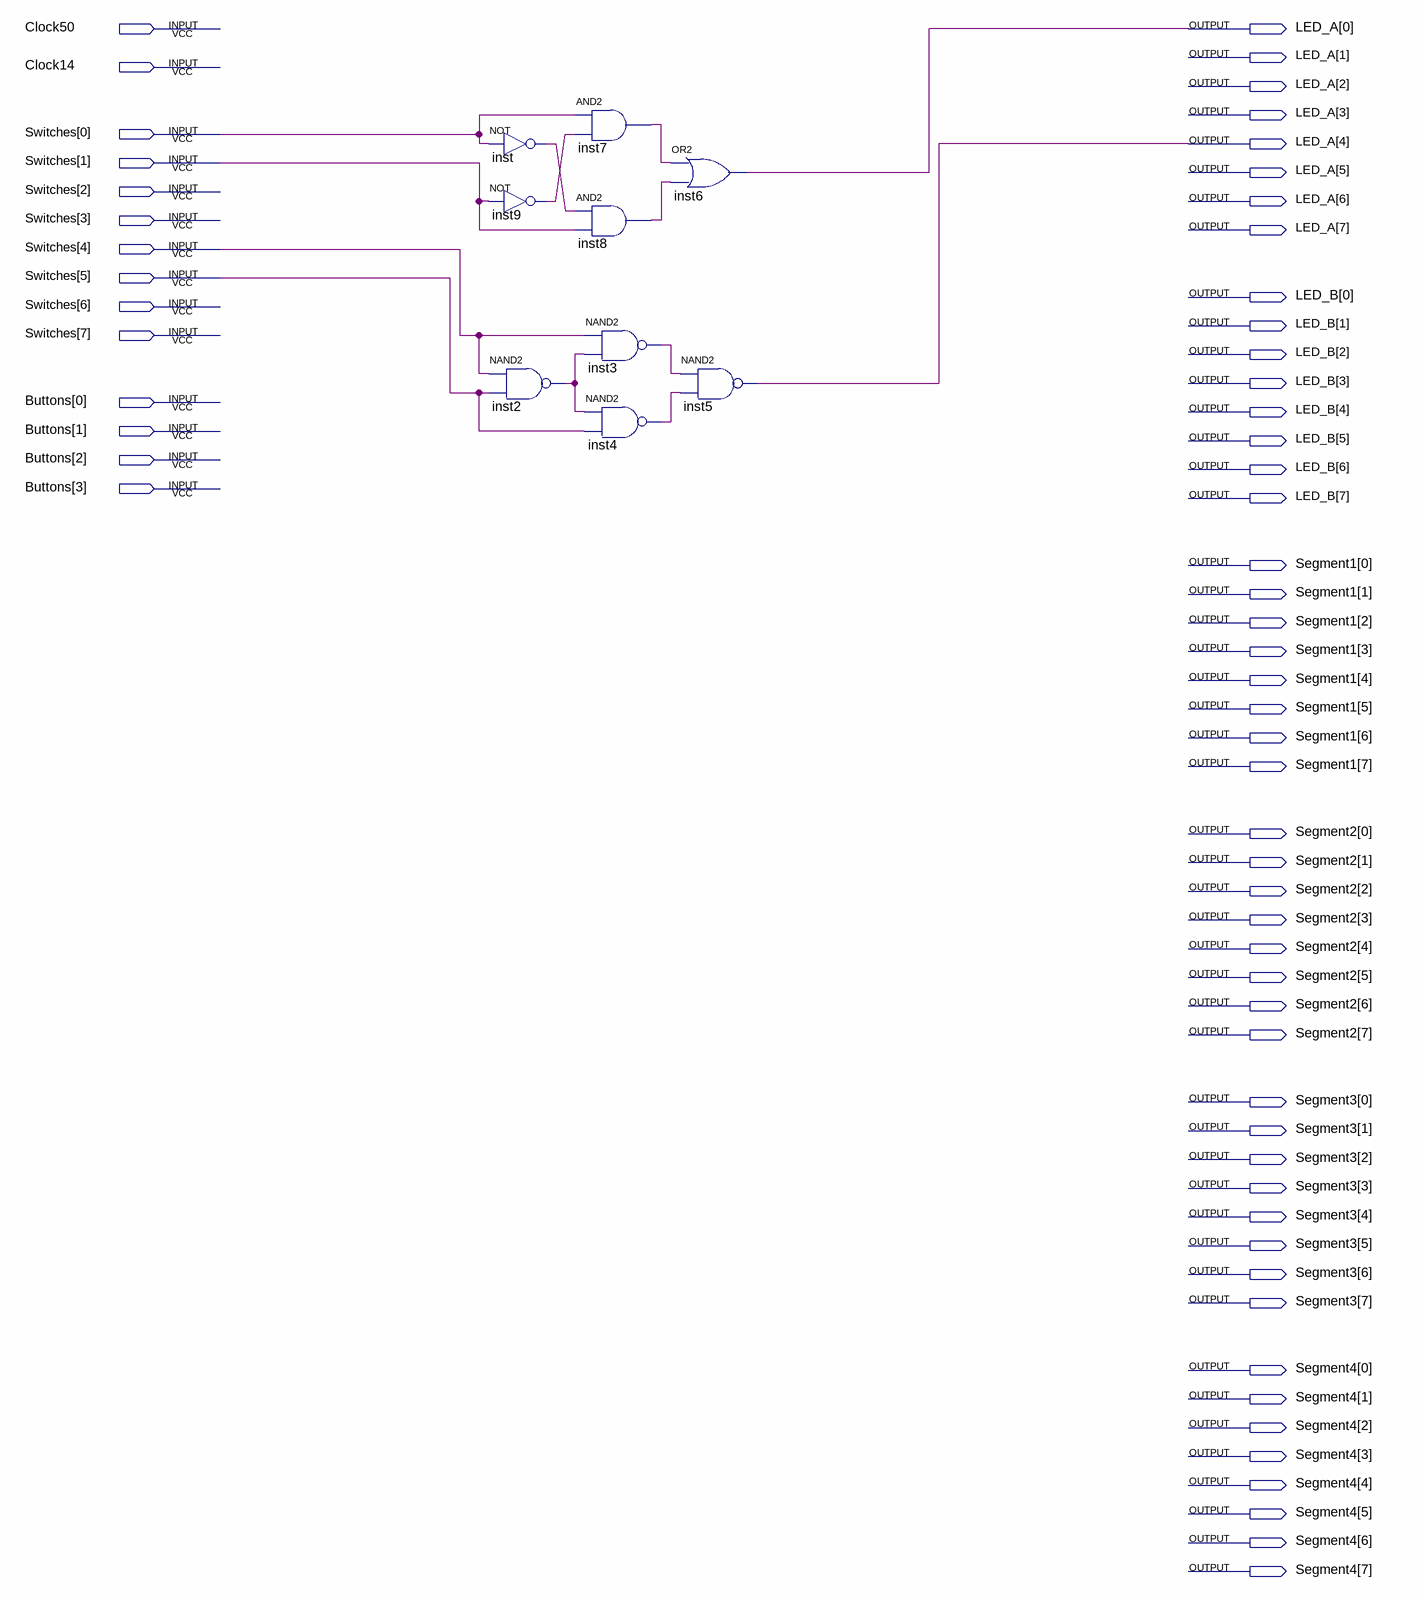
[diagram p0: schematic sheet]
// Quartus schematic EXOR.bdf as structural Verilog: 9 symbols, 62 pins
module EXOR (
  input  Clock50,
  input  Clock14,
  input  [7:0] Switches,
  input  [3:0] Buttons,
  output [7:0] LED_A,
  output [7:0] LED_B,
  output [7:0] Segment1,
  output [7:0] Segment2,
  output [7:0] Segment3,
  output [7:0] Segment4
);

  wire inst2_out, inst3_out, inst4_out, inst7_out, inst8_out, inst9_out, inst_out;

  not inst (inst_out, Switches[0]);
  not inst9 (inst9_out, Switches[1]);
  nand inst2 (inst2_out, Switches[4], Switches[5]);
  and inst7 (inst7_out, Switches[0], inst9_out);
  and inst8 (inst8_out, inst_out, Switches[1]);
  nand inst3 (inst3_out, Switches[4], inst2_out);
  nand inst4 (inst4_out, inst2_out, Switches[5]);
  or inst6 (LED_A[0], inst7_out, inst8_out);
  nand inst5 (LED_A[4], inst3_out, inst4_out);
endmodule
